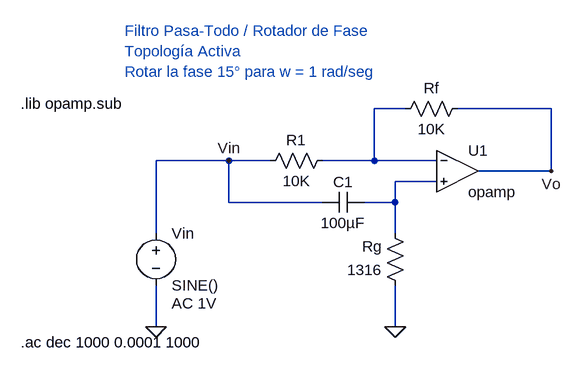
[diagram p0: schematic Filtro_PasaTodo_LatticeActivo.asc]
Filtro_PasaTodo_LatticeActivo.asc, the LTspice schematic file:
Version 4
SHEET 1 880 680
WIRE 144 32 96 32
WIRE 368 32 224 32
WIRE -128 112 -240 112
WIRE -64 112 -128 112
WIRE 96 112 96 32
WIRE 96 112 16 112
WIRE 192 112 96 112
WIRE 368 128 368 32
WIRE 368 128 256 128
WIRE 192 144 128 144
WIRE -128 176 -128 112
WIRE 16 176 -128 176
WIRE 128 176 128 144
WIRE 128 176 80 176
WIRE -240 224 -240 112
WIRE 128 224 128 176
WIRE -240 368 -240 304
WIRE 128 368 128 304
FLAG 128 368 0
FLAG -240 368 0
FLAG -128 112 Vin
FLAG 368 128 Vo
SYMBOL Opamps\\opamp 224 64 R0
SYMATTR InstName U1
SYMBOL res 32 96 R90
WINDOW 0 0 56 VBottom 2
WINDOW 3 32 56 VTop 2
SYMATTR InstName R1
SYMATTR Value 10K
SYMBOL res 240 16 R90
WINDOW 0 0 56 VBottom 2
WINDOW 3 32 56 VTop 2
SYMATTR InstName Rf
SYMATTR Value 10K
SYMBOL res 144 320 R180
WINDOW 0 36 76 Left 2
WINDOW 3 36 40 Left 2
SYMATTR InstName Rg
SYMATTR Value 1316
SYMBOL cap 80 160 R90
WINDOW 0 0 32 VBottom 2
WINDOW 3 32 32 VTop 2
SYMATTR InstName C1
SYMATTR Value 100µF
SYMBOL voltage -240 208 R0
WINDOW 123 24 124 Left 2
WINDOW 39 0 0 Left 0
SYMATTR Value2 AC 1V
SYMATTR InstName Vin
SYMATTR Value SINE()
TEXT -448 24 Left 2 !.lib opamp.sub
TEXT -448 392 Left 2 !.ac dec 1000 0.0001 1000
TEXT -288 -88 Left 2 ;Filtro Pasa-Todo / Rotador de Fase\nTopología Activa\nRotar la fase 15° para w = 1 rad/seg

The netlist it stands for:
* Filtro_PasaTodo_LatticeActivo.asc
XU1 N001 N002 Vo opamp Aol=100K GBW=10Meg  ; pins invin noninvin out
R1 N001 Vin 10K
Rf Vo N001 10K
Rg 0 N002 1316
C1 N002 Vin 100µF
Vin Vin 0 SINE() AC 1V
.lib opamp.sub
.ac dec 1000 0.0001 1000
* Filtro Pasa-Todo / Rotador de Fase
* Topología Activa
* Rotar la fase 15° para w = 1 rad/seg
.backanno
.end